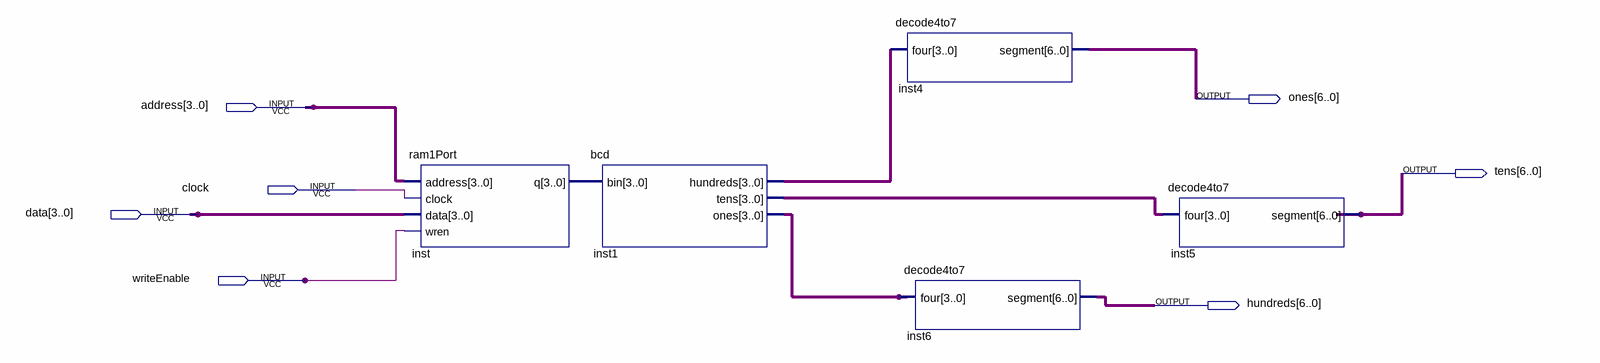
[diagram p0: schematic sheet]
// Quartus schematic LPM164.bdf as structural Verilog: 5 symbols, 7 pins
module LPM164 (
  input  [3:0] address,
  input  clock,
  input  [3:0] data,
  input  writeEnable,
  output [6:0] ones,
  output [6:0] tens,
  output [6:0] hundreds
);

  wire [3:0] inst1_hundreds, inst1_ones, inst1_tens, inst_q;

  ram1Port inst (.address(address), .clock(clock), .data(data), .wren(writeEnable), .q(inst_q));
  bcd inst1 (.bin(inst_q), .hundreds(inst1_hundreds), .tens(inst1_tens), .ones(inst1_ones));
  decode4to7 inst4 (.four(inst1_hundreds), .segment(ones));
  decode4to7 inst6 (.four(inst1_ones), .segment(hundreds));
  decode4to7 inst5 (.four(inst1_tens), .segment(tens));
endmodule
